# EAGLE design platine (EAGLE 6.6.0)
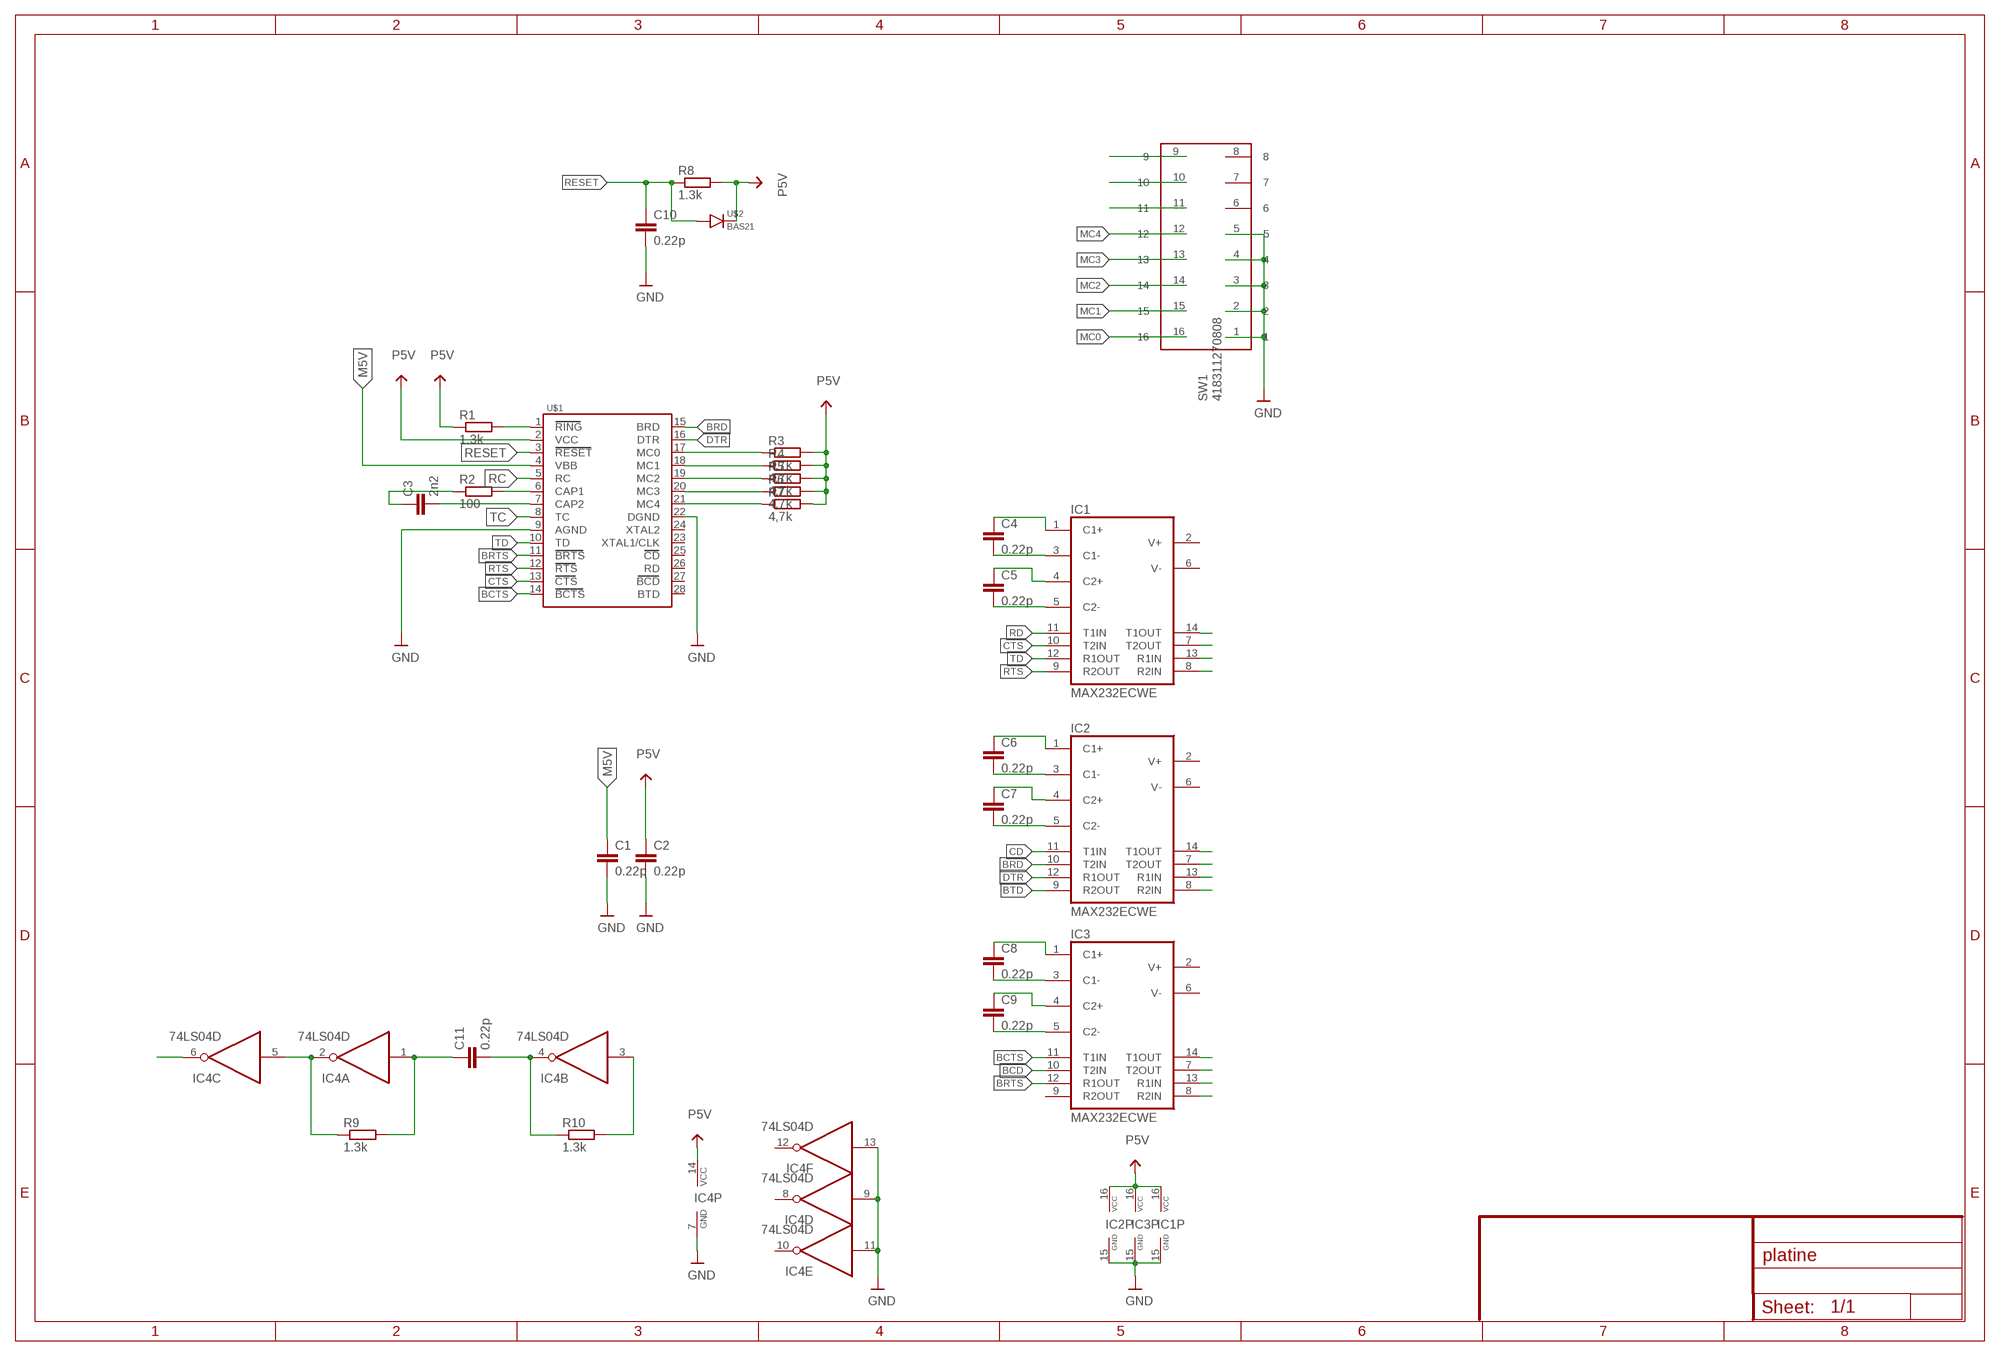
[diagram p0: schematic, sheet 1]

## Parts
C1  0.22p  C-EUC0805  [C0805]
C2  0.22p  C-EUC0805  [C0805]
C3  2n2  C-EUC0805  [C0805]
C4  0.22p  C-EUC0805  [C0805]
C5  0.22p  C-EUC0805  [C0805]
C6  0.22p  C-EUC0805  [C0805]
C7  0.22p  C-EUC0805  [C0805]
C8  0.22p  C-EUC0805  [C0805]
C9  0.22p  C-EUC0805  [C0805]
C10  0.22p  C-EUC0805  [C0805]
C11  0.22p  C-EUC0805  [C0805]
IC1  MAX232ECWE  [SO16L]
IC2  MAX232ECWE  [SO16L]
IC3  MAX232ECWE  [SO16L]
IC4  74LS04D  [SO14]
R1  1.3k  R-EU_R0805  [R0805]
R2  100  R-EU_R0805  [R0805]
R3  4,7k  R-EU_R0805  [R0805]
R4  4,7k  R-EU_R0805  [R0805]
R5  4,7k  R-EU_R0805  [R0805]
R6  4,7k  R-EU_R0805  [R0805]
R7  4,7k  R-EU_R0805  [R0805]
R8  1.3k  R-EU_R0805  [R0805]
R9  1.3k  R-EU_R0805  [R0805]
R10  1.3k  R-EU_R0805  [R0805]
SW1  418311270808  [418311270808]
U$1  AM7910  [DIL28-6]
U$2  BAS21  [SOT23]

## Nets
BCD: IC3.10(T2IN)
BCTS: IC3.11(T1IN) U$1.14(BCTS)
BRD: IC2.10(T2IN) U$1.15(BRD)
BRTS: IC3.12(R1OUT) U$1.11(BRTS)
BTD: IC2.9(R2OUT)
CD: IC2.11(T1IN)
CTS: IC1.10(T2IN) U$1.13(CTS)
DTR: IC2.12(R1OUT) U$1.16(DTR)
GND: C1.2 C2.2 C10.2 IC1.15(GND) IC2.15(GND) IC3.15(GND) IC4.7(P:GND) IC4.9(D:I) IC4.11(E:I) IC4.13(F:I) SW1.1 SW1.2 SW1.3 SW1.4 SW1.5 U$1.9(AGND) U$1.22(DGND)
M5V: C1.1 U$1.4(VBB)
MC0: R3.1 SW1.16 U$1.17(MC0)
MC1: R4.1 SW1.15 U$1.18(MC1)
MC2: R5.1 SW1.14 U$1.19(MC2)
MC3: R6.1 SW1.13 U$1.20(MC3)
MC4: R7.1 SW1.11 SW1.12 U$1.21(MC4)
N$1: R1.2 U$1.1(RING)
N$2: C5.1 IC1.4(C2+)
N$3: C3.2 U$1.7(CAP2)
N$4: R2.2 U$1.6(CAP1)
N$5: C3.1 R2.1
N$6: SW1.9
N$7: SW1.10
N$8: C5.2 IC1.5(C2-)
N$9: C4.2 IC1.3(C1-)
N$10: C4.1 IC1.1(C1+)
N$11: C7.1 IC2.4(C2+)
N$12: C7.2 IC2.5(C2-)
N$13: C6.2 IC2.3(C1-)
N$15: C6.1 IC2.1(C1+)
N$16: IC1.14(T1OUT)
N$17: IC1.7(T2OUT)
N$18: IC1.13(R1IN)
N$19: IC1.8(R2IN)
N$20: IC2.14(T1OUT)
N$21: IC2.7(T2OUT)
N$22: IC2.13(R1IN)
N$23: IC2.8(R2IN)
N$24: C9.1 IC3.4(C2+)
N$25: C9.2 IC3.5(C2-)
N$26: C8.2 IC3.3(C1-)
N$27: C8.1 IC3.1(C1+)
N$28: IC3.14(T1OUT)
N$29: IC3.7(T2OUT)
N$30: IC3.13(R1IN)
N$31: IC3.8(R2IN)
N$32: IC4.2(A:O) IC4.5(C:I) R9.1
N$33: C11.1 IC4.1(A:I) R9.2
N$34: C11.2 IC4.4(B:O) R10.1
N$35: IC4.3(B:I) R10.2
N$36: IC4.6(C:O)
P5V: C2.1 IC1.16(VCC) IC2.16(VCC) IC3.16(VCC) IC4.14(P:VCC) R1.1 R3.2 R4.2 R5.2 R6.2 R7.2 R8.2 U$1.2(VCC) U$2.3(C)
RC: U$1.5(RC)
RD: IC1.11(T1IN)
RESET: C10.1 R8.1 U$1.3(RESET) U$2.1(A)
RTS: IC1.9(R2OUT) U$1.12(RTS)
TC: U$1.8(TC)
TD: IC1.12(R1OUT) U$1.10(TD)
Unconnected: IC1.2(V+) IC1.6(V-) IC2.2(V+) IC2.6(V-) IC3.2(V+) IC3.6(V-) IC3.9(R2OUT) IC4.8(D:O) IC4.10(E:O) IC4.12(F:O) SW1.6 SW1.7 SW1.8 U$1.23(XTAL1/CLK) U$1.24(XTAL2) U$1.25(CD) U$1.26(RD) U$1.27(BCD) U$1.28(BTD)

## Library data of the parts
C1-C11 = schlager_passiv:C-EU: CAPACITOR, European symbol
IC1-IC3 = maxim:MAX232ECWE: RS232 TRANSCEIVER; MF: MAXIM; MPN: MAX232ECWE+; OC_FARNELL: 9724435; OC_NEWARK: 67K4440
IC4 = 74xx-eu:74*04: Hex INVERTER
R1-R10 = schlager_passiv:R-EU_: RESISTOR, European symbol
SW1 = Wuerth_Schiebeschalter:418311270808: WS-PT 2.54 mm piano type compact SMD Dip Switch with raised actuator, 8 Pole
U$1 = BTX:AM7910
U$2 = schlager_dioden:BAS21; MPN: BAS21; OC_ELBE: 01.41.0043.0; OC_FARNELL: 8734267RL; SUPPLIER: NXP

## Net classes
0 default: width 0.203 mm, drill 0.203 mm, clearance 0.178 mm
2 gnd: width 0.254 mm, drill 0.254 mm, clearance 0.178 mm
3 usbvcc: width 0.203 mm, drill 0.406 mm, clearance 0.178 mm
4 USBpair: width 0.254 mm, drill 0.406 mm, clearance 0.508 mm

## Board
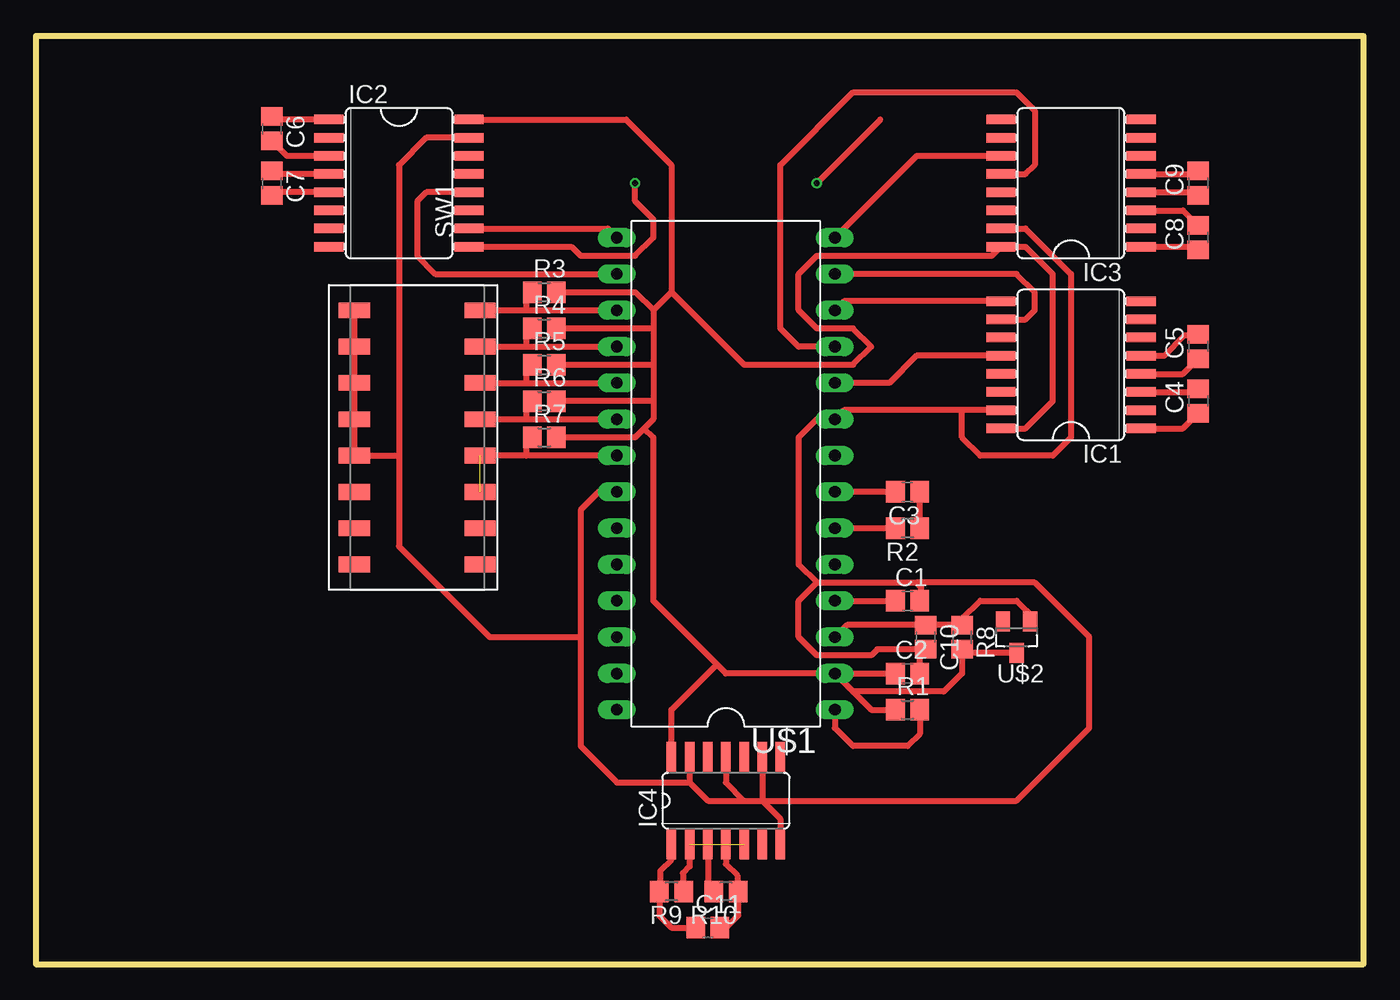
[diagram p1: board, top side]
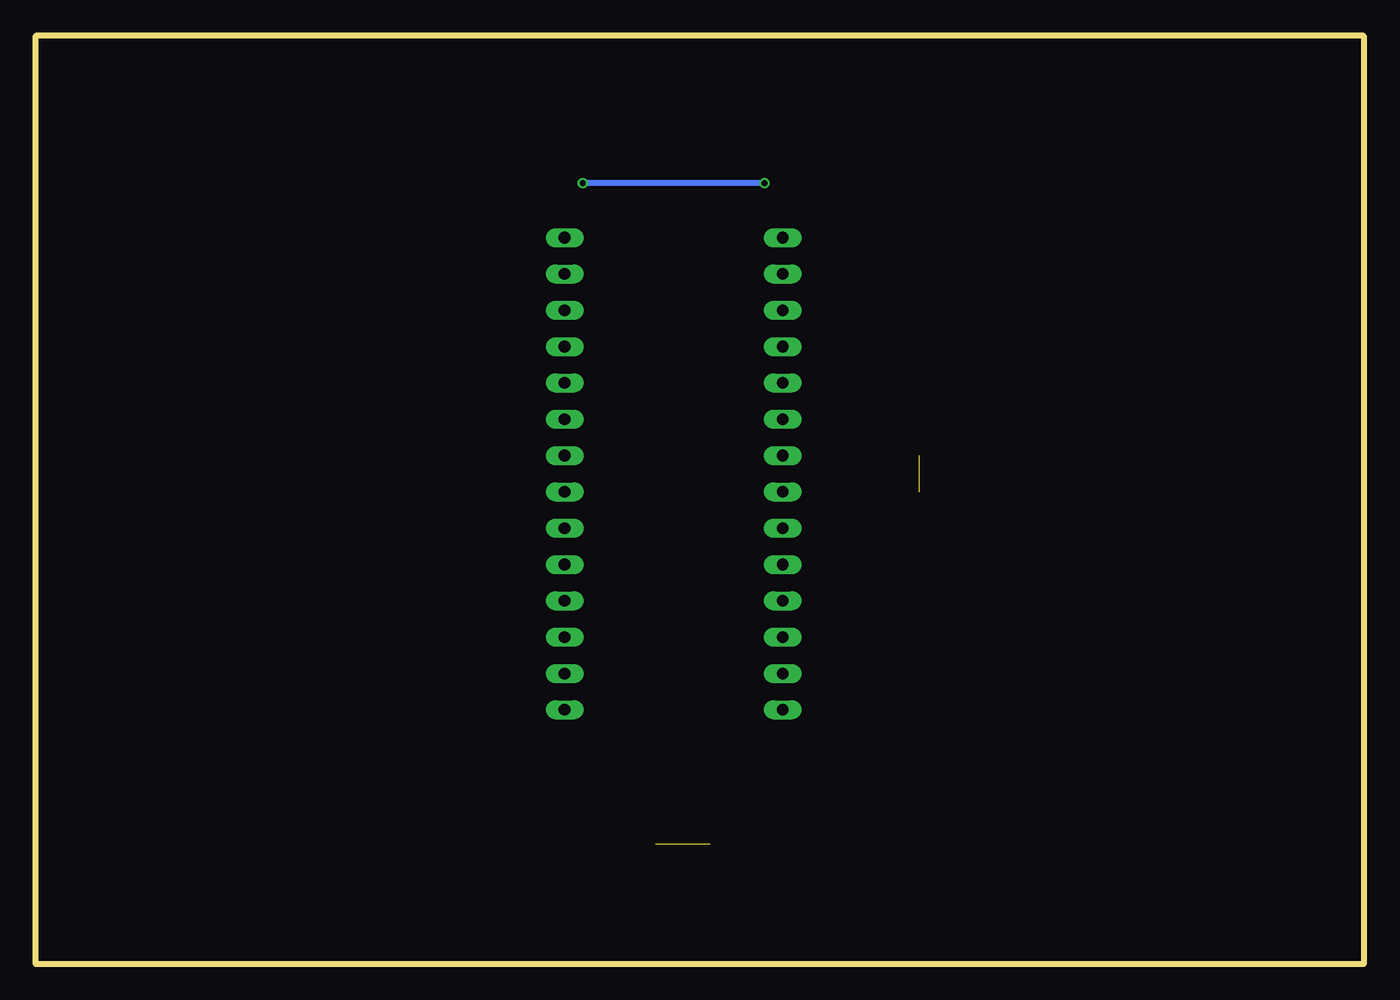
[diagram p2: board, bottom side, seen from below]

Size 92.86 x 64.92 mm. Coordinates in mm from the lower left corner, seen from the top.
Outline: 0,0 92.86,0 92.86,64.92 0,64.92 0,0
Copper layers (1*16): Top 0.035mm / dielectric 1.5mm / Bottom 0.035mm
Design rules "ITEADstudio_DRC": minimum track width 6mil, minimum drill 12mil, track to track 6mil, track to pad 6mil, pad to pad 6mil, via to via 6mil, smd to smd 0mil, copper to edge 10mil, drill to drill 10mil, minimum pad ring 10mil, minimum via ring 6mil, stop-mask expansion 2mil, vias tented up to drill 100mil, thermal gap 10mil

### Footprints (pad centres in the part's own frame; a part is rotated, then mirrored left to right if it is on the bottom)
C0805 = smd 1.3 x 1.5: 1 -0.85,0; 2 0.85,0
SO16L = smd 0.66 x 2.032: 1 -4.445,-4.902; 2 -3.175,-4.902; 3 -1.905,-4.902; 4 -0.635,-4.902; 5 0.635,-4.902; 6 1.905,-4.902; 7 3.175,-4.902; 8 4.445,-4.902; 9 4.445,4.902; 10 3.175,4.902; 11 1.905,4.902; 12 0.635,4.902; 13 -0.635,4.902; 14 -1.905,4.902; 15 -3.175,4.902; 16 -4.445,4.902
SO14 = smd 0.66 x 2.032: 1 -3.81,-3.073; 2 -2.54,-3.073; 3 -1.27,-3.073; 4 0,-3.073; 5 1.27,-3.073; 6 2.54,-3.073; 7 3.81,-3.073; 8 3.81,3.073; 9 2.54,3.073; 10 1.27,3.073; 11 0,3.073; 12 -1.27,3.073; 13 -2.54,3.073; 14 -3.81,3.073
R0805 = smd 1.3 x 1.5: 1 -0.85,0; 2 0.85,0
418311270808 = smd 1.1 x 2.2: 1 0,-4.4; 2 2.54,-4.4; 3 5.08,-4.4; 4 7.62,-4.4; 5 10.16,-4.4; 6 12.7,-4.4; 7 15.24,-4.4; 8 17.78,-4.4; 9 17.78,4.4; 10 15.24,4.4; 11 12.7,4.4; 12 10.16,4.4; 13 7.62,4.4; 14 5.08,4.4; 15 2.54,4.4; 16 0,4.4
DIL28-6 = drill 0.813 long: 1 -16.51,-7.62; 2 -13.97,-7.62; 3 -11.43,-7.62; 4 -8.89,-7.62; 5 -6.35,-7.62; 6 -3.81,-7.62; 7 -1.27,-7.62; 8 1.27,-7.62; 9 3.81,-7.62; 10 6.35,-7.62; 11 8.89,-7.62; 12 11.43,-7.62; 13 13.97,-7.62; 14 16.51,-7.62; 15 16.51,7.62; 16 13.97,7.62; 17 11.43,7.62; 18 8.89,7.62; 19 6.35,7.62; 20 3.81,7.62; 21 1.27,7.62; 22 -1.27,7.62; 23 -3.81,7.62; 24 -6.35,7.62; 25 -8.89,7.62; 26 -11.43,7.62; 27 -13.97,7.62; 28 -16.51,7.62
SOT23 = smd 1 x 1.4: 1 -0.95,-1.1; 2 0.95,-1.1; 3 0,1.1

### Placement (x,y rotation side)
C1  60.96,25.4 0 top
C2  60.96,20.32 0 top
C3  60.96,33.02 180 top
C4  81.28,39.37 90 top
C5  81.28,43.18 90 top
C6  16.51,58.42 270 top
C7  16.51,54.61 270 top
C8  81.28,50.8 90 top
C9  81.28,54.61 90 top
C10  62.23,22.86 270 top
C11  46.99,2.54 0 top
IC1  72.39,41.91 90 top
IC2  25.4,54.61 270 top
IC3  72.39,54.61 90 top
IC4  48.26,11.43 0 top
R1  60.96,17.78 0 top
R2  60.96,30.48 180 top
R3  35.56,46.99 0 top
R4  35.56,44.45 0 top
R5  35.56,41.91 0 top
R6  35.56,39.37 0 top
R7  35.56,36.83 0 top
R8  64.77,22.86 270 top
R9  44.45,5.08 180 top
R10  48.26,5.08 180 top
SW1  26.67,45.72 270 top
U$1  48.26,34.29 90 top
U$2  68.58,22.86 180 top

### Tracks (layer width: path | path; a pad name or v marks a point on that pad's centre or on a via)
BCTS
  Top 0.406: IC3.11 61.59,56.52 U$1.14
BRD
  Top 0.406: IC2.10 40.01,51.44 U$1.15
BRTS
  Top 0.406: U$1.11 53.34,43.18 52.07,44.45 52.07,55.88 57.15,60.96 68.58,60.96 69.85,59.69 69.85,55.88 69.22,55.24 IC3.12
BTD  (via drill 0.4)
  Top 0.406: IC2.9 37.47,50.16 38.1,49.53 41.91,49.53 43.18,50.8 43.18,52.07 41.91,53.34 v41.91,54.61 | v54.61,54.61 59.05,59.05
  Bottom 0.406: v41.91,54.61 v54.61,54.61
CTS
  Top 0.406: IC1.10 69.22,45.09 69.85,45.72 69.85,46.99 68.58,48.26 U$1.13
DTR
  Top 0.406: IC2.12 27.3,53.98 26.67,53.34 26.67,49.53 27.94,48.26 U$1.16
GND
  Top 0.406: C2.2 61.81,21.59 C10.2 58.84,22.01 58.42,21.59 54.61,21.59 53.34,22.86 53.34,25.4 54.61,26.67 | 54.61,26.67 61.59,26.67 | 61.59,26.67 61.91,26.35 61.91,25.5 C1.2 | IC1.15 64.77,38.73 | 64.77,38.73 56.52,38.73 U$1.9 54.61,38.1 53.34,36.83 53.34,27.94 54.61,26.67 | 50.8,11.43 52.07,10.16 IC4.7 | IC4.11 48.26,12.7 49.53,11.43 | 49.53,11.43 50.8,11.43 | IC4.13 45.72,12.7 | 45.72,12.7 46.99,11.43 49.53,11.43 | IC4.9 50.8,11.43 | 50.8,11.43 68.58,11.43 73.66,16.51 73.66,22.86 69.85,26.67 61.59,26.67 | U$1.22 39.37,33.02 38.1,31.75 38.1,22.86 | 38.1,22.86 38.1,15.24 40.64,12.7 45.72,12.7 | IC3.15 69.22,51.44 72.39,48.26 72.39,36.83 71.12,35.56 66.04,35.56 64.77,36.83 64.77,38.73 | IC2.15 27.3,57.78 25.4,55.88 25.4,35.56 | 38.1,22.86 31.75,22.86 25.4,29.21 25.4,35.56 | SW1.1 SW1.2 SW1.3 SW1.4 SW1.5 25.4,35.56
M5V
  Top 0.406: U$1.4 C1.1
MC0
  Top 0.406: SW1.16 34.29,45.72 | 34.29,45.72 U$1.17 | R3.1 34.29,46.99 34.29,45.72
MC1
  Top 0.406: SW1.15 34.29,43.18 | 34.29,43.18 U$1.18 | R4.1 34.29,44.45 34.29,43.18
MC2
  Top 0.406: SW1.14 34.29,40.64 | 34.29,40.64 U$1.19 | R5.1 34.29,41.91 34.29,40.64
MC3
  Top 0.406: SW1.13 34.29,38.1 | 34.29,38.1 U$1.20 | R6.1 34.29,39.37 34.29,38.1
MC4  (1 unrouted)
  Top 0.406: U$1.21 34.29,35.56 | 34.29,35.56 SW1.12 | R7.1 34.29,36.83 34.29,35.56
N$1
  Top 0.406: U$1.1 55.88,16.51 57.15,15.24 60.96,15.24 61.81,16.09 R1.2
N$2
  Top 0.406: IC1.4 80.22,41.27 C5.1
N$3
  Top 0.406: C3.2 U$1.7
N$4
  Top 0.406: U$1.6 R2.2
N$5
  Top 0.406: R2.1 C3.1
N$8
  Top 0.406: IC1.5 78.9,42.55 80.33,43.97 81.22,43.97 C5.2
N$9
  Top 0.406: IC1.3 81.06,40.01 C4.2
N$10
  Top 0.406: IC1.1 80.22,37.47 C4.1
N$11
  Top 0.406: IC2.4 16.73,55.24 C7.1
N$12
  Top 0.406: IC2.5 16.73,53.98 C7.2
N$13
  Top 0.406: IC2.3 17.57,56.52 C6.2
N$15
  Top 0.406: IC2.1 16.73,59.05 C6.1
N$24
  Top 0.406: IC3.4 81.06,53.98 C9.1
N$25
  Top 0.406: IC3.5 81.06,55.24 C9.2
N$26
  Top 0.406: IC3.3 80.22,52.7 C8.2
N$27
  Top 0.406: IC3.1 81.06,50.16 C8.1
N$32  (1 unrouted)
  Top 0.406: IC4.2 45.72,6.83 45.24,6.35 45.24,5.14 R9.1
N$33
  Top 0.406: C11.1 44.45,2.54 43.6,3.39 R9.2 43.66,5.14 43.66,6.51 44.45,7.3 IC4.1
N$34
  Top 0.406: C11.2 48.26,2.54 49.11,3.39 R10.1 49.05,5.14 49.05,6.19 48.26,6.99 IC4.4
N$35
  Top 0.406: IC4.3 46.99,5.5 R10.2
P5V
  Top 0.406: R3.2 41.91,46.99 43.18,45.72 | 43.18,44.45 R4.2 | 43.18,39.37 R6.2 | 43.18,45.72 43.18,44.45 | 43.18,44.45 43.18,41.91 | 43.18,41.91 43.18,39.37 | 43.18,39.37 43.18,38.1 42.55,37.47 | 42.55,37.47 41.91,36.83 R7.2 | R5.2 43.18,41.91 | U$2.3 65.02,21.76 R8.2 64.77,20.32 63.5,19.05 57.15,19.05 | U$1.2 57.15,19.05 | 57.15,19.05 58.42,17.78 R1.1 | U$1.2 C2.1 | U$1.2 48.26,20.32 47.62,20.95 | 47.62,20.95 43.18,25.4 43.18,36.83 42.55,37.47 | IC4.14 44.45,17.78 47.62,20.95 | IC2.16 41.27,59.05 44.45,55.88 44.45,46.99 | IC1.16 69.22,37.47 71.12,39.37 71.12,48.26 69.22,50.16 IC3.16 66.85,49.53 54.61,49.53 53.34,48.26 53.34,45.72 54.61,44.45 57.15,44.45 58.42,43.18 57.15,41.91 49.53,41.91 44.45,46.99 | 44.45,46.99 43.18,45.72
RESET
  Top 0.406: U$2.1 69.7,24.13 69.85,24.13 68.58,25.4 66.04,25.4 64.77,24.13 R8.1 C10.1 56.73,23.71 U$1.3
RTS
  Top 0.406: IC1.9 56.52,46.35 U$1.12
TD
  Top 0.406: IC1.12 61.59,42.55 59.69,40.64 U$1.10

### Text on the board
_tNames: R5 | R3